# EAGLE design EMS esp32 wifi lora gsm v2.7.1 (EAGLE 9.5.2)
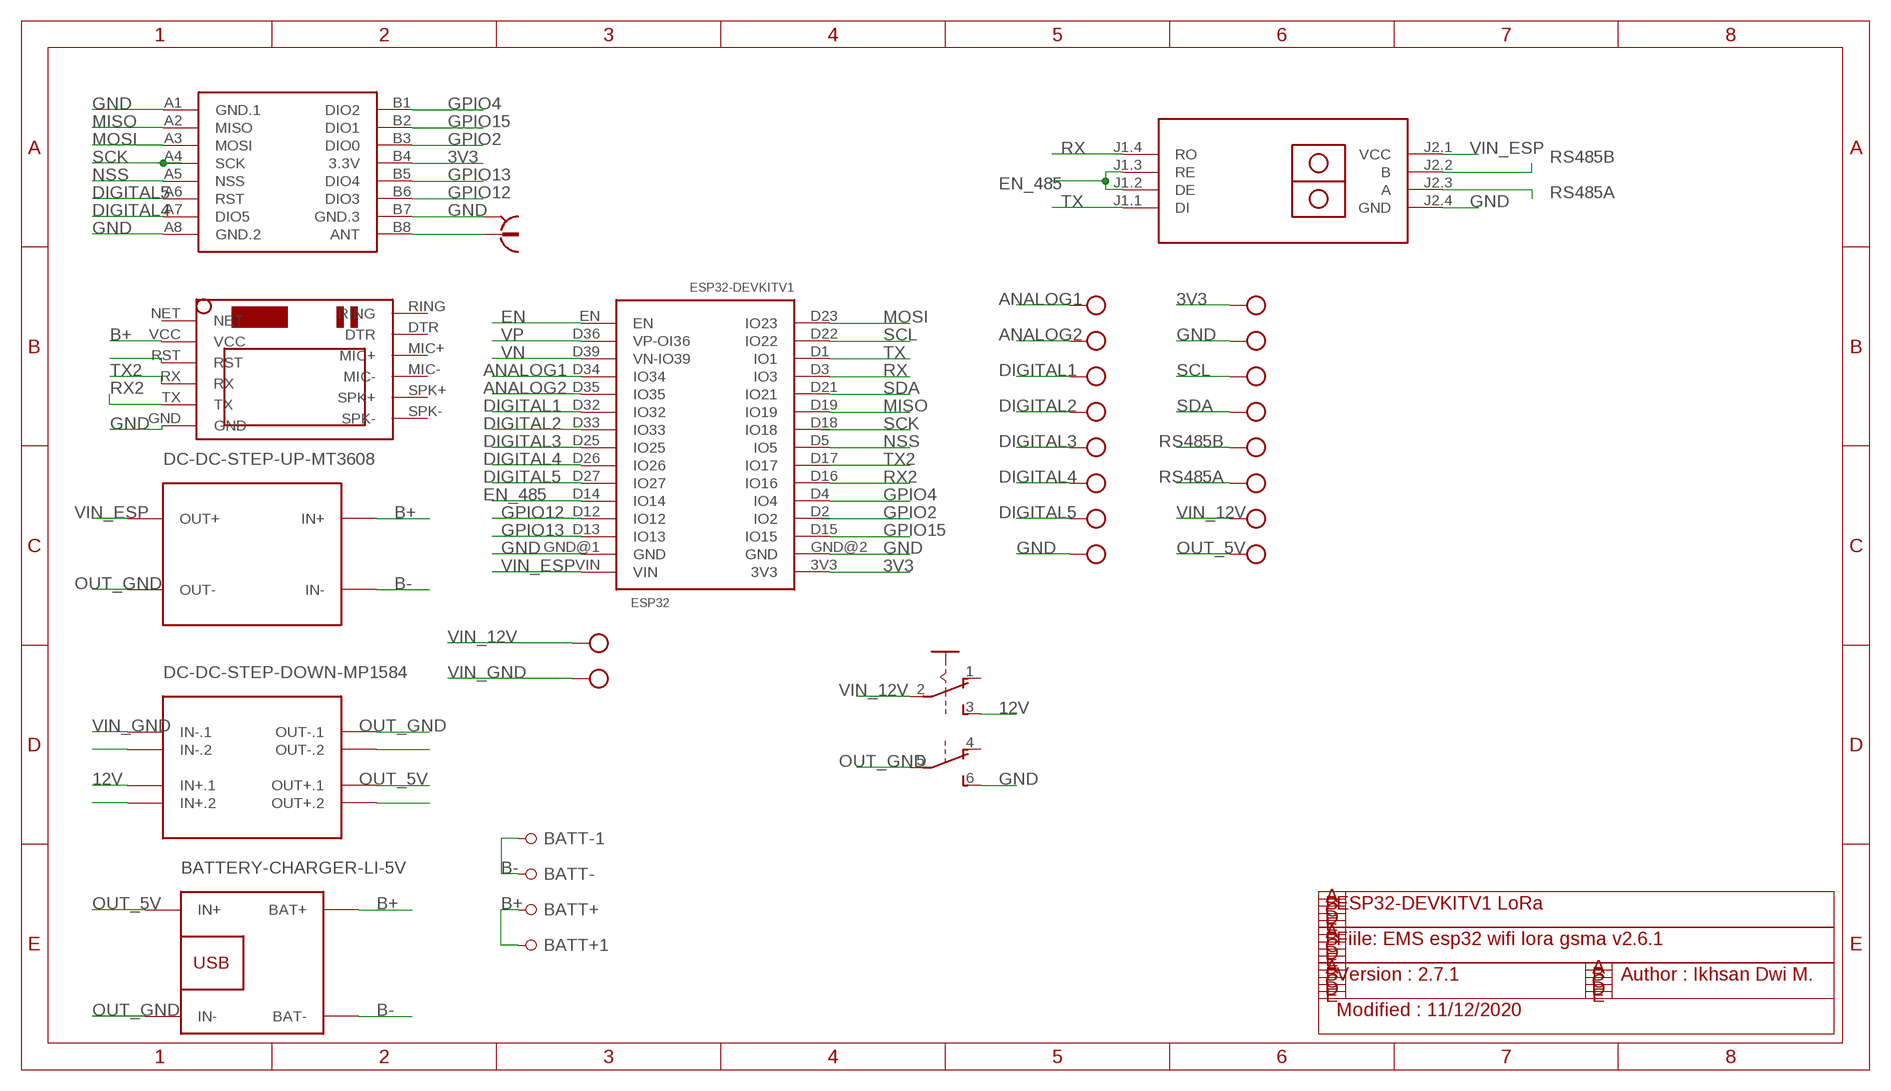
[diagram p0: schematic, sheet 1]

## Parts
BATT+  PIN-1X1_2.00  [1X01M]
BATT+1  PIN-1X1_2.00  [1X01M]
BATT-  PIN-1X1  [1X01NONAME]
BATT-1  PIN-1X1  [1X01NONAME]
ESP32  ESP32DEVKITV1  [ESP32-DEVKITV1]
S1  A68-A31  [A68-A31]
U$1  RS485-TTL-CONVERTER  [RS485-TTL-CONVERTER]
U$2  DC-DC-STEP-UP-MT3608  [DC-DC-STEP-UP-MT3608]
U$3  DC-DC-STEP-DOWN-MP1584  [DC-DC-STEP-DOWN-MP1584]
U$4  BATTERY-CHARGER-LI-5V  [BATTERY-CHARGER-LI-5V]
U$5  WIRELESS-LORA-RFM95W#SMD  [WIRELESS-LORA-RFM95W#SMD]
U$9  SIM800LMODULE  [SIM800LMODULE]
X1  734120110  [734120110]
X2  MKDSN1,5/2-5,08  [MKDSN1,5/2-5,08]
X3  MKDSN1,5/2-5,08  [MKDSN1,5/2-5,08]
X4  MKDSN1,5/2-5,08  [MKDSN1,5/2-5,08]
X5  MKDSN1,5/2-5,08  [MKDSN1,5/2-5,08]
X6  MKDSN1,5/2-5,08  [MKDSN1,5/2-5,08]
X7  MKDSN1,5/2-5,08  [MKDSN1,5/2-5,08]
X8  MKDSN1,5/2-5,08  [MKDSN1,5/2-5,08]
X9  MKDSN1,5/2-5,08  [MKDSN1,5/2-5,08]
X10  MKDSN1,5/2-5,08  [MKDSN1,5/2-5,08]

## Nets
3V3: ESP32.3V3 U$5.B4(3.3V) X4.1
12V [usbvcc]: S1.3(A:S) U$3.IN+.1
ANALOG1: ESP32.D34(IO34) X2.1
ANALOG2: ESP32.D35(IO35) X2.2
B+: BATT+1.1 BATT+.1 U$2.IN+ U$4.BAT+ U$9.VCC
B-: BATT-1.1 BATT-.1 U$2.IN- U$4.BAT-
DIGITAL1: ESP32.D32(IO32) X3.1
DIGITAL2: ESP32.D33(IO33) X3.2
DIGITAL3: ESP32.D25(IO25) X5.1
DIGITAL4: ESP32.D26(IO26) U$5.A7(DIO5) X5.2
DIGITAL5: ESP32.D27(IO27) U$5.A6(RST) X6.1
EN: ESP32.EN
EN_485: ESP32.D14(IO14) U$1.J1.2(DE) U$1.J1.3(RE)
GND: ESP32.GND@1(GND) ESP32.GND@2(GND) S1.6(B:S) U$1.J2.4(GND) U$5.A1(GND.1) U$5.A8(GND.2) U$5.B7(GND.3) U$9.GND X1.S@1 X1.S@2 X1.S@3 X4.2 X6.2
GPIO2: ESP32.D2(IO2) U$5.B3(DIO0)
GPIO4: ESP32.D4(IO4) U$5.B1(DIO2)
GPIO12: ESP32.D12(IO12) U$5.B6(DIO3)
GPIO13: ESP32.D13(IO13) U$5.B5(DIO4)
GPIO15: ESP32.D15(IO15) U$5.B2(DIO1)
MISO: ESP32.D19(IO19) U$5.A2(MISO)
MOSI: ESP32.D23(IO23) U$5.A3(MOSI)
N$2: U$9.RST
N$7: U$3.IN-.2
N$8: U$5.B8(ANT) X1.1
N$10: U$3.IN+.2
N$12: U$3.OUT-.2
N$14: U$3.OUT+.2
NSS: ESP32.D5(IO5) U$5.A5(NSS)
OUT_5V: U$3.OUT+.1 U$4.IN+ X9.2
OUT_GND: S1.5(B:P) U$2.OUT- U$3.OUT-.1 U$4.IN-
RS485A: U$1.J2.3(A) X8.2
RS485B: U$1.J2.2(B) X8.1
RX: ESP32.D3(IO3) U$1.J1.4(RO)
RX2: ESP32.D16(IO16) U$9.TX
SCK: ESP32.D18(IO18) U$5.A4(SCK)
SCL: ESP32.D22(IO22) X7.1
SDA: ESP32.D21(IO21) X7.2
TX: ESP32.D1(IO1) U$1.J1.1(DI)
TX2: ESP32.D17(IO17) U$9.RX
VIN_12V [usbvcc]: S1.2(A:P) X9.1 X10.1
VIN_ESP [usbvcc]: ESP32.VIN U$1.J2.1(VCC) U$2.OUT+
VIN_GND [usbvcc]: U$3.IN-.1 X10.2
VN: ESP32.D39(VN-IO39)
VP: ESP32.D36(VP-OI36)
Unconnected: S1.1(A:O) S1.4(B:O) U$9.DTR U$9.MIC+ U$9.MIC- U$9.NET U$9.RING U$9.SPK+ U$9.SPK-

## Notes on the sheet
- ESP32-DEVKITV1 LoRa
- Fiile: EMS esp32 wifi lora gsma v2.6.1
- Version : 2.7.1 | Author : Ikhsan Dwi M.
- Modified : 11/12/2020

## Library data of the parts
BATT+ BATT+1 BATT- BATT-1 = pinhead-fixdrills:PIN-1X1: PIN HEADER
ESP32 = ESP32-DEVKITV1:ESP32DEVKITV1
S1 = switch:A68-A31: SLIDING SWITCH Siemens, distributor Buerklin, 11G766
U$1 = diy-modules:RS485-TTL-CONVERTER: RS485 to TTL converter based on MAX485 chip
U$2 = diy-modules:DC-DC-STEP-UP-MT3608: DC/DC Step-Up Regulator based on MT3608 chip MT3608 datasheet available here: https://www.olimex.com/Products/Breadboarding/BB-PWR-3608/resources/MT3608.pdf Click here to find device on ebay.com <http://www.ebay.com/sch/mt3608+module>
U$3 = diy-modules:DC-DC-STEP-DOWN-MP1584: DC/DC Step-Down Regulator based on MP1584 chip MP1584 datasheet available here: http://www.haoyuelectronics.com/Attachment/MP1584/MP1584.pdf Click here to find device on ebay.com <http://www.ebay.com/sch/mp1584+module>
U$4 = diy-modules:BATTERY-CHARGER-LI-5V: Lithium Battery 5V Charger More details available here: http://www.buildcircuit.com/how-to-use-micro-usb-5v-1a-lithium-battery-charging-board-charger-module/ Click here to find device on ebay.com <http://www.ebay.com/sch/tp4056+charger+usb>
U$5 = diy-modules:WIRELESS-LORA-RFM95W: 868/915 MHz LoRa Radio Transceiver Module based on SX1276 chip Click here to find device on ebay.com <http://www.ebay.com/sch/RFM95W+transceiver>
U$9 = SIM800LMODULE:SIM800LMODULE: SIM800L Module
X1 = con-coax:734120110: MICRO COAXIAL CONNECTOR RECEPTACLE VERTICAL Source: Data sheet <http://www.molex.com/pdm_docs/sd/734120110_sd.pdf>
X2-X10 = con-phoenix-508:MKDSN1,5/2-5,08: MKDSN 1,5/ 2-5,08 Printklemme Nennstrom: 13,5 A Nennspannung: 250 V Rastermaß: 5,08 mm Polzahl: 2 Anschlussart: Schraubanschluss Montage: Löten Anschlussrichtung Leiter/Platine: 0 ° Artikelnummer: 1729128 Source: http://eshop.phoenixcontact.com .. 1729128.pdf

## Net classes
1 power: width 0.61 mm, drill 0.508 mm, clearance 0.152 mm
2 gnd: width 0.305 mm, drill 0.508 mm, clearance 0.152 mm
3 usbvcc: width 0.508 mm, drill 0.508 mm, clearance 0.152 mm

## Board
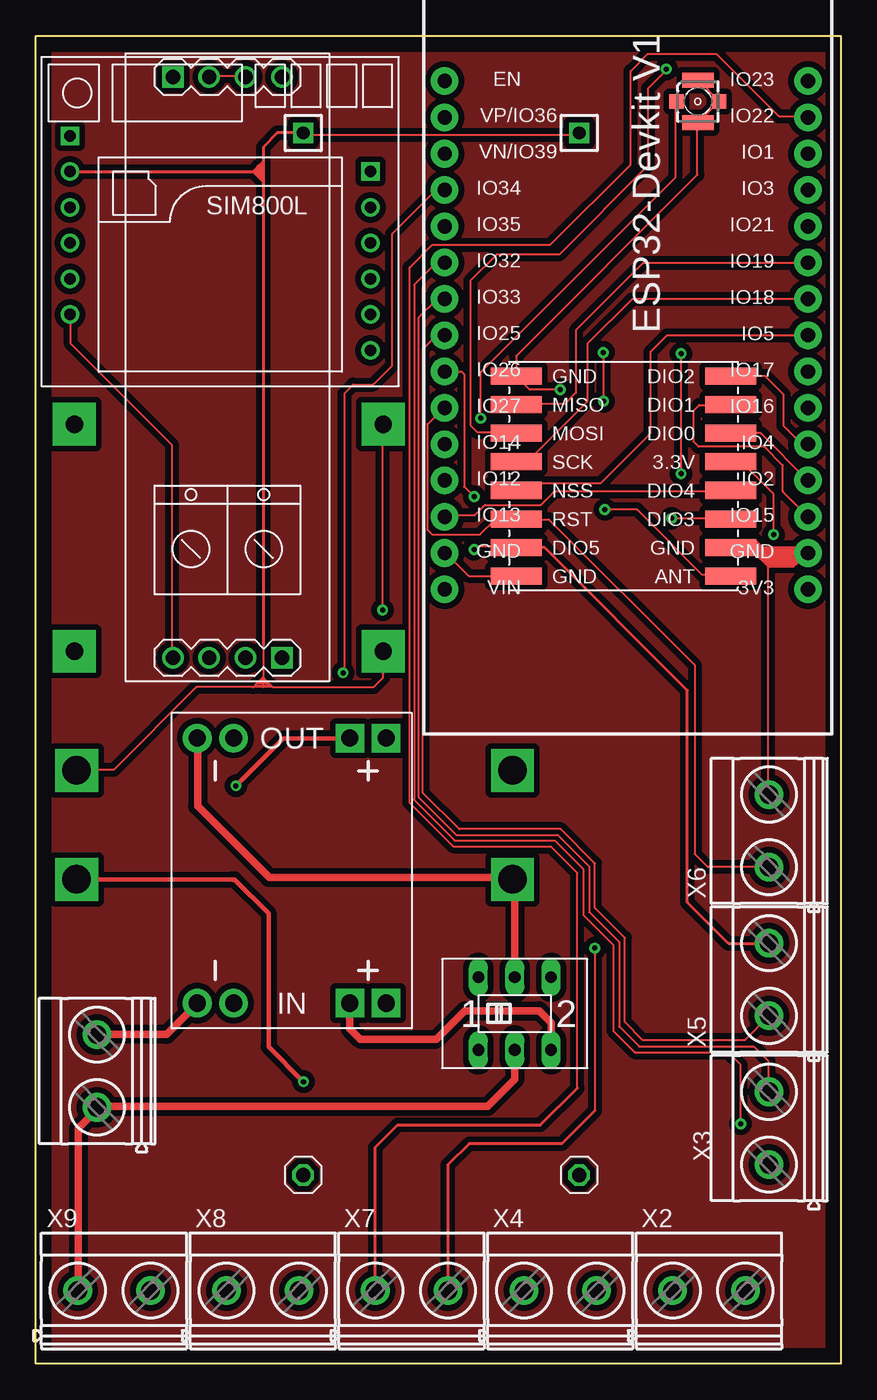
[diagram p1: board, top side]
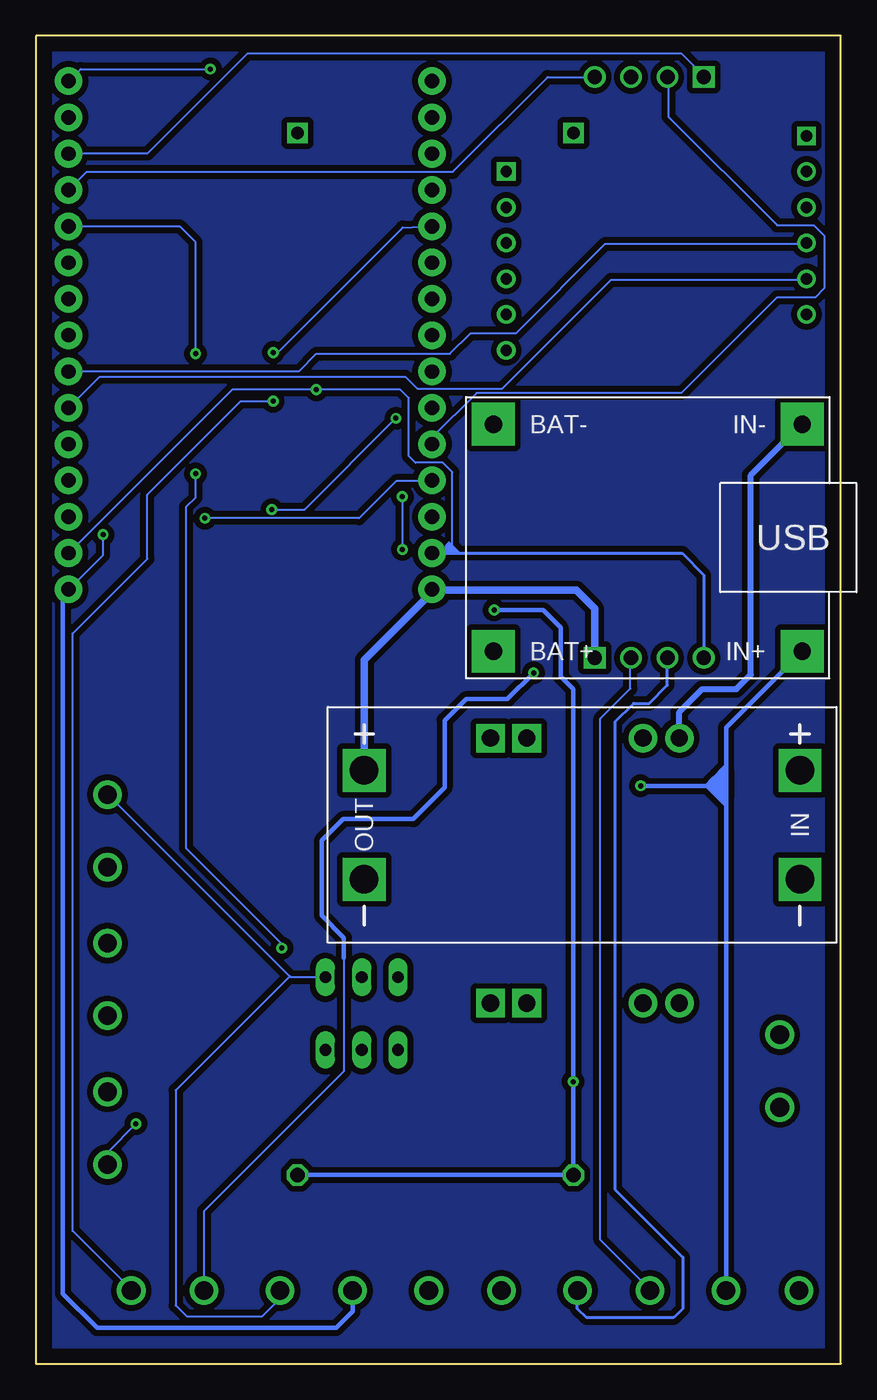
[diagram p2: board, bottom side, seen from below]

Size 56.3 x 92.9 mm. Coordinates in mm from the lower left corner, seen from the top.
Outline: 0,92.9 56.3,92.9 56.3,0 0,0 0,92.9
Copper layers (1*16): Top 0.035mm / dielectric 1.5mm / Bottom 0.035mm
Design rules "default": minimum track width 6mil, minimum drill 0.35mm, track to track 6mil, track to pad 6mil, pad to pad 6mil, via to via 6mil, smd to smd 6mil, copper to edge 40mil, drill to drill 6mil, minimum pad ring 10mil, minimum via ring 8mil, stop-mask expansion 4mil, vias tented up to drill 0mil, thermal gap 10mil

### Footprints (pad centres in the part's own frame; a part is rotated, then mirrored left to right if it is on the bottom)
1X01M = drill 0.9 square: 1 0,0
1X01NONAME = drill 1 octagon: 1 0,0
ESP32-DEVKITV1 = drill 1 pad 1.93: 3V3 -16.52,-12.27; D1 13.96,-12.27; D2 -8.9,-12.27; D3 11.42,-12.27; D4 -6.36,-12.27; D5 1.26,-12.27; D12 -8.9,13.135; D13 -11.44,13.135; D14 -6.36,13.135; D15 -11.44,-12.27; D16 -3.82,-12.27; D17 -1.28,-12.27; D18 3.8,-12.27; D19 6.34,-12.27; D21 8.88,-12.27; D22 16.5,-12.27; D23 19.04,-12.27; D25 1.26,13.135; D26 -1.28,13.135; D27 -3.82,13.135; D32 6.34,13.135; D33 3.8,13.135; D34 11.42,13.135; D35 8.88,13.135; D36 16.5,13.135; D39 13.96,13.135; EN 19.04,13.135; GND@1 -13.98,13.135; GND@2 -13.98,-12.27; VIN -16.52,13.135
A68-A31 = drill 0.813 long: 1 -2.54,-2.54; 2 0,-2.54; 3 2.54,-2.54; 4 -2.54,2.54; 5 0,2.54; 6 2.54,2.54
RS485-TTL-CONVERTER = drill 1 square: J1.1 -20.32,-3.81; J2.1 20.32,3.81 | drill 1: J1.2 -20.32,-1.27; J1.3 -20.32,1.27; J1.4 -20.32,3.81; J2.2 20.32,1.27; J2.3 20.32,-1.27; J2.4 20.32,-3.81
DC-DC-STEP-UP-MT3608 = drill 2 pad 2.8 square: IN+ 15.24,3.81; IN- 15.24,-3.81; OUT+ -15.24,3.81; OUT- -15.24,-3.81
DC-DC-STEP-DOWN-MP1584 = drill 1.2 pad 2 square: IN+.1 -9.271,-4.064; IN+.2 -9.271,-6.604; OUT+.1 9.271,-4.064; OUT+.2 9.271,-6.604 | drill 1.2 pad 2: IN-.1 -9.271,6.604; IN-.2 -9.271,4.064; OUT-.1 9.271,6.604; OUT-.2 9.271,4.064
BATTERY-CHARGER-LI-5V = drill 1.2 pad 3 square: BAT+ 10.795,8.255; BAT- 10.795,-7.62; IN+ -10.795,8.255; IN- -10.795,-7.62
WIRELESS-LORA-RFM95W#SMD = smd 3.6 x 1.2: A1 -7.5,7; A2 -7.5,5; A3 -7.5,3; A4 -7.5,1; A5 -7.5,-1; A6 -7.5,-3; A7 -7.5,-5; A8 -7.5,-7; B1 7.5,7; B2 7.5,5; B3 7.5,3; B4 7.5,1; B5 7.5,-1; B6 7.5,-3; B7 7.5,-5; B8 7.5,-7
SIM800LMODULE = drill 0.8: DTR 10.5,1; GND -10.5,-6.5; MIC+ 10.5,-1.5; MIC- 10.5,-4; RST -10.5,1; RX -10.5,-1.5; SPK+ 10.5,-6.5; SPK- 10.5,-9; TX -10.5,-4; VCC -10.5,3.5 | drill 0.8 square: NET -10.5,6; RING 10.5,3.5
734120110 = smd 1 x 1: 1 0,-1.5; S@1 0,1.5 | smd 1.05 x 2.2: S@2 -1.475,0; S@3 1.475,0
MKDSN1,5/2-5,08 = drill 1.3 pad 2: 1 -2.561,0.025; 2 2.519,0.025

### Placement (x,y rotation side)
BATT+  38,86.1 270 top
BATT+1  18.7,86.1 270 top
BATT-  38,13.2 270 top
BATT-1  18.7,13.2 270 top
ESP32  41.73,70.69 90 top
S1  33.5,24.5 0 top
U$1  13.4,69.7 270 top
U$2  18.1,37.7 0 bottom
U$3  17.9,34.5 90 top
U$4  13.5,58.1 180 bottom
U$5  41.1,62.1 0 top
U$9  12.9,79.9 0 top
X1  46.3,88.3 270 top
X2  47.1,5.1 0 top
X3  51.3,16.5 90 top
X4  36.7,5.1 0 top
X5  51.3,26.9 90 top
X6  51.3,37.3 90 top
X7  26.3,5.1 0 top
X8  15.9,5.1 0 top
X9  5.5,5.1 0 top
X10  4.3,20.5 90 top

### Tracks (layer width: path | path; a pad name or v marks a point on that pad's centre or on a via)
3V3  (via drill 0.35)
  Top 0.152: 53.97,54.24 ESP32.3V3 | v51.59,58 51.59,60.83 49.39,63.03 48.63,63.03 U$5.B4
  Bottom 0.152: v51.59,58 51.59,56.56 53.97,54.19 ESP32.3V3
  Bottom 0.305: ESP32.3V3 54.4,53.77 54.4,4.9 52,2.5 35.3,2.5 34.14,3.66 X4.1
12V
  Top 0.508: U$3.IN+.1 21.96,23.44 22.7,22.7 28,22.7 30,24.7 35.2,24.7 36.04,23.86 S1.3
ANALOG1  (via drill 0.35)
  Top 0.152: 28.52,82.13 ESP32.D34 27.98,82.11 24.92,79.05 24.92,69.82 23.6,68.5 22.2,68.5 21.59,67.89 21.59,48.44 v21.49,48.34
  Bottom 0.152: v21.49,48.34 21.49,48.18 | 34.75,28.4 34.75,20.46 44.52,10.69 44.52,5.2 X2.1
  Bottom 0.305: v21.49,48.34 23.33,46.5 26.2,46.5 27.7,45 27.7,40.3 29.9,38.1 34.8,38.1 36.3,36.6 36.3,31.36 34.75,29.8 34.75,28.4
ANALOG2  (via drill 0.35)
  Top 0.152: v39.69,70.74 39.69,67.34 v39.7,67.33
  Bottom 0.152: v39.69,70.74 39.39,70.74 30.64,79.49 ESP32.D35 | X2.2 49.62,5.2 53.72,9.29 53.72,51.08 51.7,53.1 48.5,56.3 48.5,60.8 41.97,67.33 v39.7,67.33
B+
  Top 0.152: 18.69,86.04 BATT+1.1 18.69,85.97 37.91,85.97 BATT+.1 | 16.59,47.33 15.91,47.33 | 15.91,47.33 15.2,47.33 | 15.2,47.33 11.24,47.33 5.46,41.54 2.91,41.54 U$2.IN+ | 15.91,47.33 15.91,47.8 | 15.91,47.8 15.91,48 | 15.91,50.3 15.91,48 | 15.91,82.2 15.91,82.7 15.91,83.4 | 15.2,47.33 15.34,47.46 | 15.34,47.46 15.49,47.61 | 15.49,47.61 15.64,47.76 | 15.64,47.76 15.84,47.96 | 15.84,47.96 15.88,48 15.91,48 | 15.91,48 16.26,47.66 | 16.45,47.46 16.26,47.66 | 16.45,47.46 16.59,47.33 | 15.34,47.46 16.2,47.46 | 16.2,47.46 16.45,47.46 | 15.49,47.61 16.1,47.61 | 16.1,47.61 16.21,47.61 | 16.21,47.61 16.26,47.66 | 16.21,47.61 16.2,47.6 16.2,47.46 | 15.64,47.76 15.95,47.76 16.1,47.61 | 15.91,47.8 15.84,47.88 15.84,47.96 | U$4.BAT+ 24.3,48 23.62,47.33 16.59,47.33
  Top 0.2: 15.91,84.1 15.91,85.11 16.9,86.1 BATT+1.1 | 15.91,84.1 15.91,83.4 | 15.91,83.4 15.21,83.4 | U$9.VCC 15.21,83.4 | 15.91,84.1 15.71,83.89 | 15.71,83.89 15.61,83.79 | 15.61,83.79 15.46,83.64 | 15.46,83.64 15.21,83.4 | 15.21,83.4 15.46,83.16 | 15.46,83.16 15.56,83.06 | 15.56,83.06 15.71,82.91 | 15.71,82.91 15.91,82.7 | 15.91,83.4 15.91,82.2 15.91,50.3 | 15.71,83.89 15.71,82.91 | 15.61,83.79 15.61,83.11 15.56,83.06 | 15.46,83.64 15.46,83.16
B-  (via drill 0.35)
  Top 0.152: 13.8,33.85 13.94,33.85 16.24,31.54 | v24.25,52.73 24.25,65.7 U$4.BAT-
  Top 0.305: U$2.IN- 13.76,33.89 | 13.8,33.85 13.76,33.89 | 13.76,33.89 13.89,33.89 16.24,31.54 16.29,31.49 16.29,22.17 v18.72,19.74
  Bottom 0.305: BATT-.1 BATT-1.1 18.72,13.22 v18.72,19.74 18.72,47.2 19.6,48.08 19.6,51.5 20.83,52.73 v24.25,52.73
BOTTOM
  pour Bottom (isolate 0.406): 29.2,0.5 55.7,0.5 55.7,92.2 0.3,92.2 0.3,89.8 0.3,0.5
DIGITAL1  (via drill 0.35)
  Top 0.152: 28.52,77.1 ESP32.D32 28.01,77.03 26.46,75.48 26.46,39.44 29.3,36.6 36.3,36.6 38.3,34.6 38.3,31.4 40.4,29.3 40.4,23.3 41.9,21.8 48.4,21.8 49.29,20.91 v49.29,16.79
  Bottom 0.152: X3.1 51.27,14.81 v49.29,16.79
DIGITAL2
  Top 0.152: 28.52,74.51 ESP32.D33 28.08,74.49 26.76,73.17 26.76,39.64 29.4,37 36.5,37 38.7,34.8 38.7,31.6 40.8,29.5 40.8,23.6 42.2,22.2 50.2,22.2 51.22,21.18 51.22,19.06 X3.2
DIGITAL3
  Top 0.152: 28.52,71.99 ESP32.D25 28.03,71.95 27.07,70.98 27.07,39.93 29.6,37.4 36.7,37.4 39.1,35 39.1,31.9 41.2,29.8 41.2,23.9 42.46,22.64 49.57,22.64 X5.1 51.22,24.4
DIGITAL4  (via drill 0.35)
  Top 0.152: 28.52,69.48 ESP32.D26 29.78,69.41 29.96,69.22 29.96,61.36 v30.66,60.66 | 35.3,57.09 33.62,57.09 U$5.A7 33.54,57.16 30.86,57.16 v30.66,56.96
  Top 0.2: X5.2 48.43,29.42 45.56,32.29 45.56,47.11 35.58,57.09 35.3,57.09
  Bottom 0.152: v30.66,60.66 v30.66,56.96
DIGITAL5
  Top 0.152: 28.52,66.89 ESP32.D27 28.52,66.84 27.37,65.7 27.37,58.37 27.73,58 31.05,58 32.12,59.07 33.54,59.07 U$5.A6 33.62,59.07 35.88,59.07 46.07,48.88 46.07,35.67 47,34.74 X6.1
EN
  Top 0.152: 28.52,89.75 ESP32.EN
EN_485
  Top 0.152: 28.52,64.37 ESP32.D14 | U$1.J1.2 12.13,90.08 14.65,90.08 U$1.J1.3
  Bottom 0.152: ESP32.D14 28.59,64.4 28.59,64.78 25.47,67.91 11.16,67.91 4.47,74.59 1.8,74.59 1.16,75.23 1.16,78.93 1.88,79.65 4.46,79.65 12.06,87.24 12.06,90.01 U$1.J1.2
GND  (via drill 0.35)
  Top 0.152: 28.52,56.75 ESP32.GND@1 28.67,56.71 30.27,55.11 33.54,55.11 U$5.A8 | 54.02,56.72 ESP32.GND@2 53.97,56.78 53.82,56.93 53.66,57.09 53.3,57.09 51.22,57.09 | 48.61,57.13 U$5.B7 48.63,57.09 50.5,57.09 50.7,57.09 51,57.09 51.1,57.09 51.22,57.09 | 51.22,55.8 51.22,39.87 X6.2 | 51.22,56 51.22,56.1 51.22,56.3 | 51.22,57.09 51.22,57 | 47.79,88.33 46.35,89.78 X1.S@2 | 47.79,88.33 46.35,86.88 X1.S@3 46.27,86.81 46.27,83.18 33.6,70.5 U$5.A1 | 47.79,88.33 X1.S@1 | U$5.A1 33.62,69.13 U$5.A1 | U$9.GND 2.46,73.39 2.46,71.36 9.54,64.27 9.54,49.39 U$1.J2.4 | U$5.A1 34.56,68.14 v36.68,68.14
  Top 0.2: U$5.B7 49.92,57.1 50.66,56.36 | 50.66,56.36 50.76,56.26 | 50.76,56.26 50.96,56.06 | 50.96,56.06 51.22,55.8 | U$5.B7 50.22,57.1 50.41,56.91 | 50.41,56.91 51.11,56.21 | 51.11,56.21 51.22,56.1 51.23,56.11 53.29,56.11 | 51.22,55.8 51.22,56 | 51.22,56 51.22,56.3 | 51.22,56.3 51.22,56.5 | 51.22,56.5 51.22,56.6 | 51.22,56.6 51.22,56.8 | 51.22,56.8 51.22,57 51.3,56.93 53.82,56.93 | 51.11,56.21 51.11,57.08 | 51.1,57.09 51.11,57.08 | 51.22,56 51.11,56.11 51.11,56.21 | 50.96,56.06 50.96,57 | 50.96,57 50.96,57.05 51,57.09 | 50.76,56.26 50.76,56.8 50.87,56.91 | 50.96,57 50.88,56.92 | 50.66,56.36 50.66,57.05 50.7,57.09 | 50.7,57.1 50.86,57.1 50.96,57 | U$5.B7 50.6,57.1 | 50.6,57.1 50.7,57.1 | 50.7,57.1 50.88,56.92 | 50.88,56.92 50.87,56.91 | 50.87,56.91 50.41,56.91 | 50.5,57.09 53.3,57.09 | 51.22,55.8 52.98,55.8 53.14,55.96 | 53.14,55.96 53.29,56.11 | 53.29,56.11 53.39,56.21 | 53.39,56.21 53.59,56.41 | 53.59,56.41 53.78,56.6 | 53.78,56.6 53.84,56.66 | 53.84,56.66 53.97,56.78 | 51.22,56 53.1,56 53.14,55.96 | 51.22,56.3 53.3,56.3 53.39,56.21 | 51.22,56.5 53.5,56.5 53.59,56.41 | 51.22,56.6 53.78,56.6 | 51.22,56.8 53.7,56.8 53.84,56.66 | 51.11,57.08 50.82,57.08 50.3,57.6 50.3,57.4 50.6,57.1
  Bottom 0.152: 54.02,56.64 ESP32.GND@2 53.97,56.78 53.92,56.78 42.56,68.14 v36.68,68.14 30.8,68.14 30.21,67.55 30.21,63.49 29.75,63.03 27.83,63.03 27.17,62.37 27.17,57.2 | 38.54,27.1 51.22,39.79 X6.2 | 38.54,27.1 38.5,27.07 36.06,27.07 S1.6 | X4.2 39.22,4.56 40.46,3.32 45.75,3.32 46.51,4.09 46.51,19.13 38.54,27.1 | 26.68,56.71 27.37,56.71 | 27.37,56.71 28.1,56.71 ESP32.GND@1 | 27.37,56.71 27.37,57 27.37,57.2 27.37,57.4
  Bottom 0.2: 27.14,57.16 27.17,57.2 27.37,57.4 27.41,57.4 27.8,57 | 27.14,57.16 27.04,57.06 | 27.04,57.06 26.89,56.91 | 26.89,56.91 26.79,56.81 | 26.79,56.81 26.68,56.71 | 27.8,57 28.1,56.71 | ESP32.GND@1 28,56.71 | 28,56.71 26.68,56.71 | 26.68,56.71 11.11,56.71 9.59,55.19 U$1.J2.4 | 26.79,56.81 27.9,56.81 28,56.71 | ESP32.GND@1 27.39,56.71 27.04,57.06 | 27.14,57.16 27.21,57.16 27.37,57 | 26.89,56.91 27.71,56.91 27.8,57 | ESP32.GND@1 27.86,56.71 27.37,57.2
GPIO2
  Top 0.152: U$5.B3 48.63,65.09 50.69,65.09 53.97,61.81 ESP32.D2
GPIO4
  Top 0.152: ESP32.D4 53.57,64.33 52.3,65.6 52.3,67.8 51,69.1 U$5.B1
GPIO12  (via drill 0.35)
  Top 0.152: 28.52,61.86 ESP32.D12 | v44.47,59.15 48.56,59.15 U$5.B6
  Bottom 0.152: v44.47,59.15 33.69,59.15 31.1,61.74 28.67,61.74 ESP32.D12
GPIO13
  Top 0.152: 28.52,59.27 ESP32.D13 28.67,59.3 28.74,59.37 30.69,59.37 31.4,60.08 35.32,60.08 36.29,61.05 48.56,61.05 U$5.B5
GPIO15
  Top 0.152: U$5.B2 48.56,67.07 46.39,67.07 46,66.67 46,64.5 46.36,64.15 50.94,64.15 52.25,62.84 52.25,61.02 53.97,59.3 ESP32.D15
MISO
  Top 0.152: U$5.A2 33.62,67.15 37,67.15 37.78,67.92 37.78,72.3 42.45,76.98 53.97,76.98 ESP32.D19
MOSI  (via drill 0.35)
  Top 0.152: 54.05,89.75 ESP32.D23 | U$5.A3 33.54,65.16 30.88,65.16 30.4,65.65 30.4,75.78 32.22,77.6 36.6,77.6 42.8,83.8 42.8,89.2 44.09,90.49 v44.09,90.57
  Bottom 0.152: ESP32.D23 53.16,90.57 v44.09,90.57
N$8  (via drill 0.35)
  Top 0.152: 48.61,55.15 U$5.B8 48.56,55.18 46.62,55.18 42.05,59.76 v39.79,59.76 | v31.11,66.14 31.11,69.36 44.75,83 44.75,88.25 X1.1
  Bottom 0.152: v39.79,59.76 37.49,59.76 v31.11,66.14
NSS
  Top 0.152: 34.69,61.13 33.62,61.13 U$5.A5 34.1,61.6 39.5,61.6 43,65.1 43,70.8 44.15,71.95 53.97,71.95 ESP32.D5
OUT_5V  (via drill 0.35)
  Top 0.305: U$3.OUT+.1 21.95,43.75 17.32,43.75 v14,40.43
  Bottom 0.152: 8.02,44.4 8.02,41.8 8.02,40.6 8.02,40.43 8.02,40 8.02,5.2 X9.2 | 2.92,49.62 2.76,49.77 U$4.IN+
  Bottom 0.305: X9.2 8.02,39.1 | 8.02,39.1 8.02,39.58 | 8.02,41.5 8.02,44.4 8.02,44.52 2.92,49.62 | v14,40.43 9.38,40.43 | 9.35,40.43 8.02,40.43 | 9.38,40.43 8.96,40.86 | 8.96,40.86 8.66,41.16 | 8.66,41.16 8.36,41.46 | 8.36,41.46 8.02,41.8 | 9.38,40.43 9.35,40.43 | 9.35,40.43 8.91,39.99 | 8.91,39.99 8.41,39.49 | 8.41,39.49 8.36,39.44 | 8.26,39.34 8.02,39.1 | 8.02,41.5 8.41,41.11 8.41,39.9 | 8.41,39.9 8.41,39.49 | 8.66,41.16 8.66,40.15 8.41,39.9 | 8.96,40.86 8.91,40.81 8.91,39.99 | 8.36,41.46 8.36,41 | 8.36,41 8.36,40.9 | 8.36,40.9 8.36,40.3 | 8.36,40.3 8.36,39.92 | 8.36,39.92 8.36,39.44 | 8.36,39.44 8.26,39.34 | 8.02,41.5 8.02,41.2 | 8.02,41.2 8.02,39.58 | 8.02,39.58 8.26,39.34 | 8.02,39.58 8.36,39.92 | 8.02,40 8.32,40.3 8.36,40.3 | 8.02,40.6 8.32,40.9 8.36,40.9 | 8.02,41.2 8.22,41 8.36,41
OUT_GND
  Top 0.152: 16.31,34.01 16.4,33.92 33.32,33.92 U$2.OUT-
  Top 0.508: S1.5 33.5,33.73 U$2.OUT- 33.22,34.01 16.31,34.01 11.31,39.01 11.31,43.76 U$3.OUT-.1
  Bottom 0.152: 11.29,45.07 11.29,43.83 U$3.OUT-.1 | 2.76,65.7 U$4.IN-
  Bottom 0.406: U$3.OUT-.1 11.3,45.6 9.7,47.2 7.3,47.2 6.3,48.2 6.3,62.16 2.76,65.7
RS485A
  Bottom 0.152: 12.13,48.56 12.13,49.32 U$1.J2.3 | 15.81,12.21 15.75,12.15 | 11.06,3.9 11.06,3.86 | 11.66,3.26 11.69,3.22 | 18.42,5.1 X8.2
  Bottom 0.2: 12.13,49.32 12.13,47.47 13.4,46.2 14.49,46.2 15.81,44.88 15.81,12.21 | 15.75,12.15 11.06,7.45 11.06,3.9 | 11.06,3.86 11.66,3.26 | 11.69,3.22 17.79,3.22 18.42,3.86 18.42,5.1
RS485B
  Bottom 0.152: U$1.J2.2 14.72,49.32 14.72,47.23 16.81,45.13 16.81,8.66 13.35,5.2 X8.1
RX
  Top 0.152: 54.05,82.13 ESP32.D3
  Bottom 0.152: U$1.J1.4 17.24,90.01 20.51,90.01 27.13,83.38 52.75,83.38 53.97,82.16 ESP32.D3
RX2
  Bottom 0.152: 2.43,75.83 U$9.TX 2.46,75.83 16.06,75.83 23.68,68.21 29.62,68.21 30.45,69.05 51.83,69.05 53.97,66.92 ESP32.D16
SCK
  Top 0.152: U$5.A4 33.62,63.11 34.38,63.11 38.58,67.31 38.58,71.35 41.7,74.46 53.97,74.46 ESP32.D18
SCL
  Top 0.152: 54.05,87.23 ESP32.D22 53.97,87.26 51.97,87.26 47.59,91.64 42.81,91.64 41.59,90.43 41.59,83.89 35.97,78.27 27.73,78.27 26.15,76.69 26.15,39.25 29.2,36.2 36,36.2 37.87,34.33 37.87,19.28 | 23.79,5.2 X7.1
  Top 0.2: X7.1 23.74,15.14 25.3,16.7 35.3,16.7 37.87,19.28
SDA  (via drill 0.35)
  Top 0.152: 54.05,79.61 ESP32.D21 | v45.13,62.26 v45.13,70.65 | v39.09,29.08 39.09,17.7 | 28.82,7.42 28.82,5.2 X7.2
  Top 0.2: 39.09,17.7 36.79,15.4 30.3,15.4 28.8,13.9 28.8,5.22 28.82,5.2
  Bottom 0.152: 54.02,79.5 ESP32.D21 46.25,79.57 45.13,78.45 v45.13,70.65 | v45.13,62.26 45.13,60.6 45.78,59.95 45.78,36.06 39.09,29.38 v39.09,29.08
TOP
  pour Top (isolate 0.406): 29.1,0.5 55.8,0.5 55.8,92.2 0.5,92.2 0.5,1.4 0.5,0.5
TX
  Top 0.152: 54.05,84.64 ESP32.D1
  Bottom 0.152: U$1.J1.1 9.59,90.11 11.15,91.67 41.48,91.67 48.48,84.67 53.97,84.67 ESP32.D1
TX2
  Bottom 0.152: 53.95,69.44 ESP32.D17 53.89,69.43 37.89,69.43 36.67,70.65 27.33,70.65 25.89,72.09 22.72,72.09 16.46,78.35 2.46,78.35 U$9.RX
VIN_12V
  Top 0.508: S1.2 33.5,19.9 31.6,18 4.28,18 X10.1 4.21,17.69 2.99,16.47 2.99,5.2 X9.1
VIN_ESP
  Bottom 0.508: U$1.J2.1 17.21,52.83 18.5,54.12 28.59,54.12 ESP32.VIN 28.67,53.89 33.32,49.24 33.32,41.54 U$2.OUT+
VIN_GND
  Top 0.508: X10.2 9.16,23.03 11.29,25.16 U$3.IN-.1
VN
  Top 0.152: 28.52,84.72 ESP32.D39
VP
  Top 0.152: 28.52,87.23 ESP32.D36